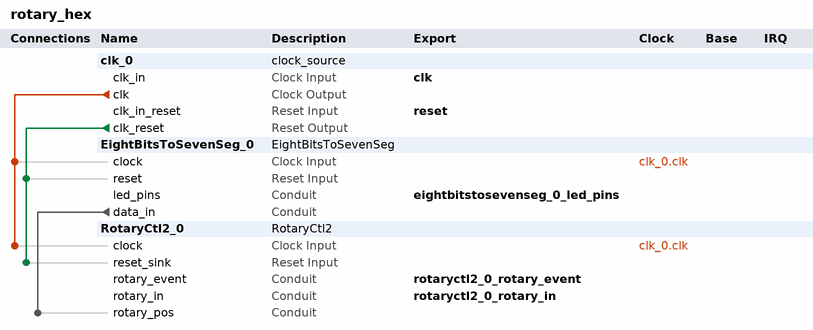
[diagram p0: system contents]
# Platform Designer (Qsys) system rotary_hex, Cyclone V 5CSEMA5F31C6
# Parameters at their usual value, and those the tool derives, are not listed.
package require -exact qsys 16.1
create_system rotary_hex
set_project_property DEVICE_FAMILY {Cyclone V}
set_project_property DEVICE 5CSEMA5F31C6

add_instance clk_0 clock_source 16.1
set_instance_parameter_value clk_0 clockFrequency 50000000

add_instance EightBitsToSevenSeg_0 EightBitsToSevenSeg 1.0

add_instance RotaryCtl2_0 RotaryCtl2 1.0

# connections
add_connection clk_0.clk EightBitsToSevenSeg_0.clock clock
add_connection clk_0.clk RotaryCtl2_0.clock clock
add_connection clk_0.clk_reset EightBitsToSevenSeg_0.reset reset
add_connection clk_0.clk_reset RotaryCtl2_0.reset_sink reset
add_connection EightBitsToSevenSeg_0.data_in RotaryCtl2_0.rotary_pos conduit

# exported interfaces
add_interface clk clock sink
set_interface_property clk EXPORT_OF clk_0.clk_in
add_interface eightbitstosevenseg_0_led_pins conduit end
set_interface_property eightbitstosevenseg_0_led_pins EXPORT_OF EightBitsToSevenSeg_0.led_pins
add_interface reset reset sink
set_interface_property reset EXPORT_OF clk_0.clk_in_reset
add_interface rotaryctl2_0_rotary_event conduit end
set_interface_property rotaryctl2_0_rotary_event EXPORT_OF RotaryCtl2_0.rotary_event
add_interface rotaryctl2_0_rotary_in conduit end
set_interface_property rotaryctl2_0_rotary_in EXPORT_OF RotaryCtl2_0.rotary_in

set_interconnect_requirement {$system} qsys_mm.clockCrossingAdapter HANDSHAKE
set_interconnect_requirement {$system} qsys_mm.enableEccProtection FALSE
set_interconnect_requirement {$system} qsys_mm.insertDefaultSlave FALSE
set_interconnect_requirement {$system} qsys_mm.maxAdditionalLatency 1

save_system rotary_hex.qsys
